# Altium schematic sheet 04 SWITCH.SchDoc
size A3
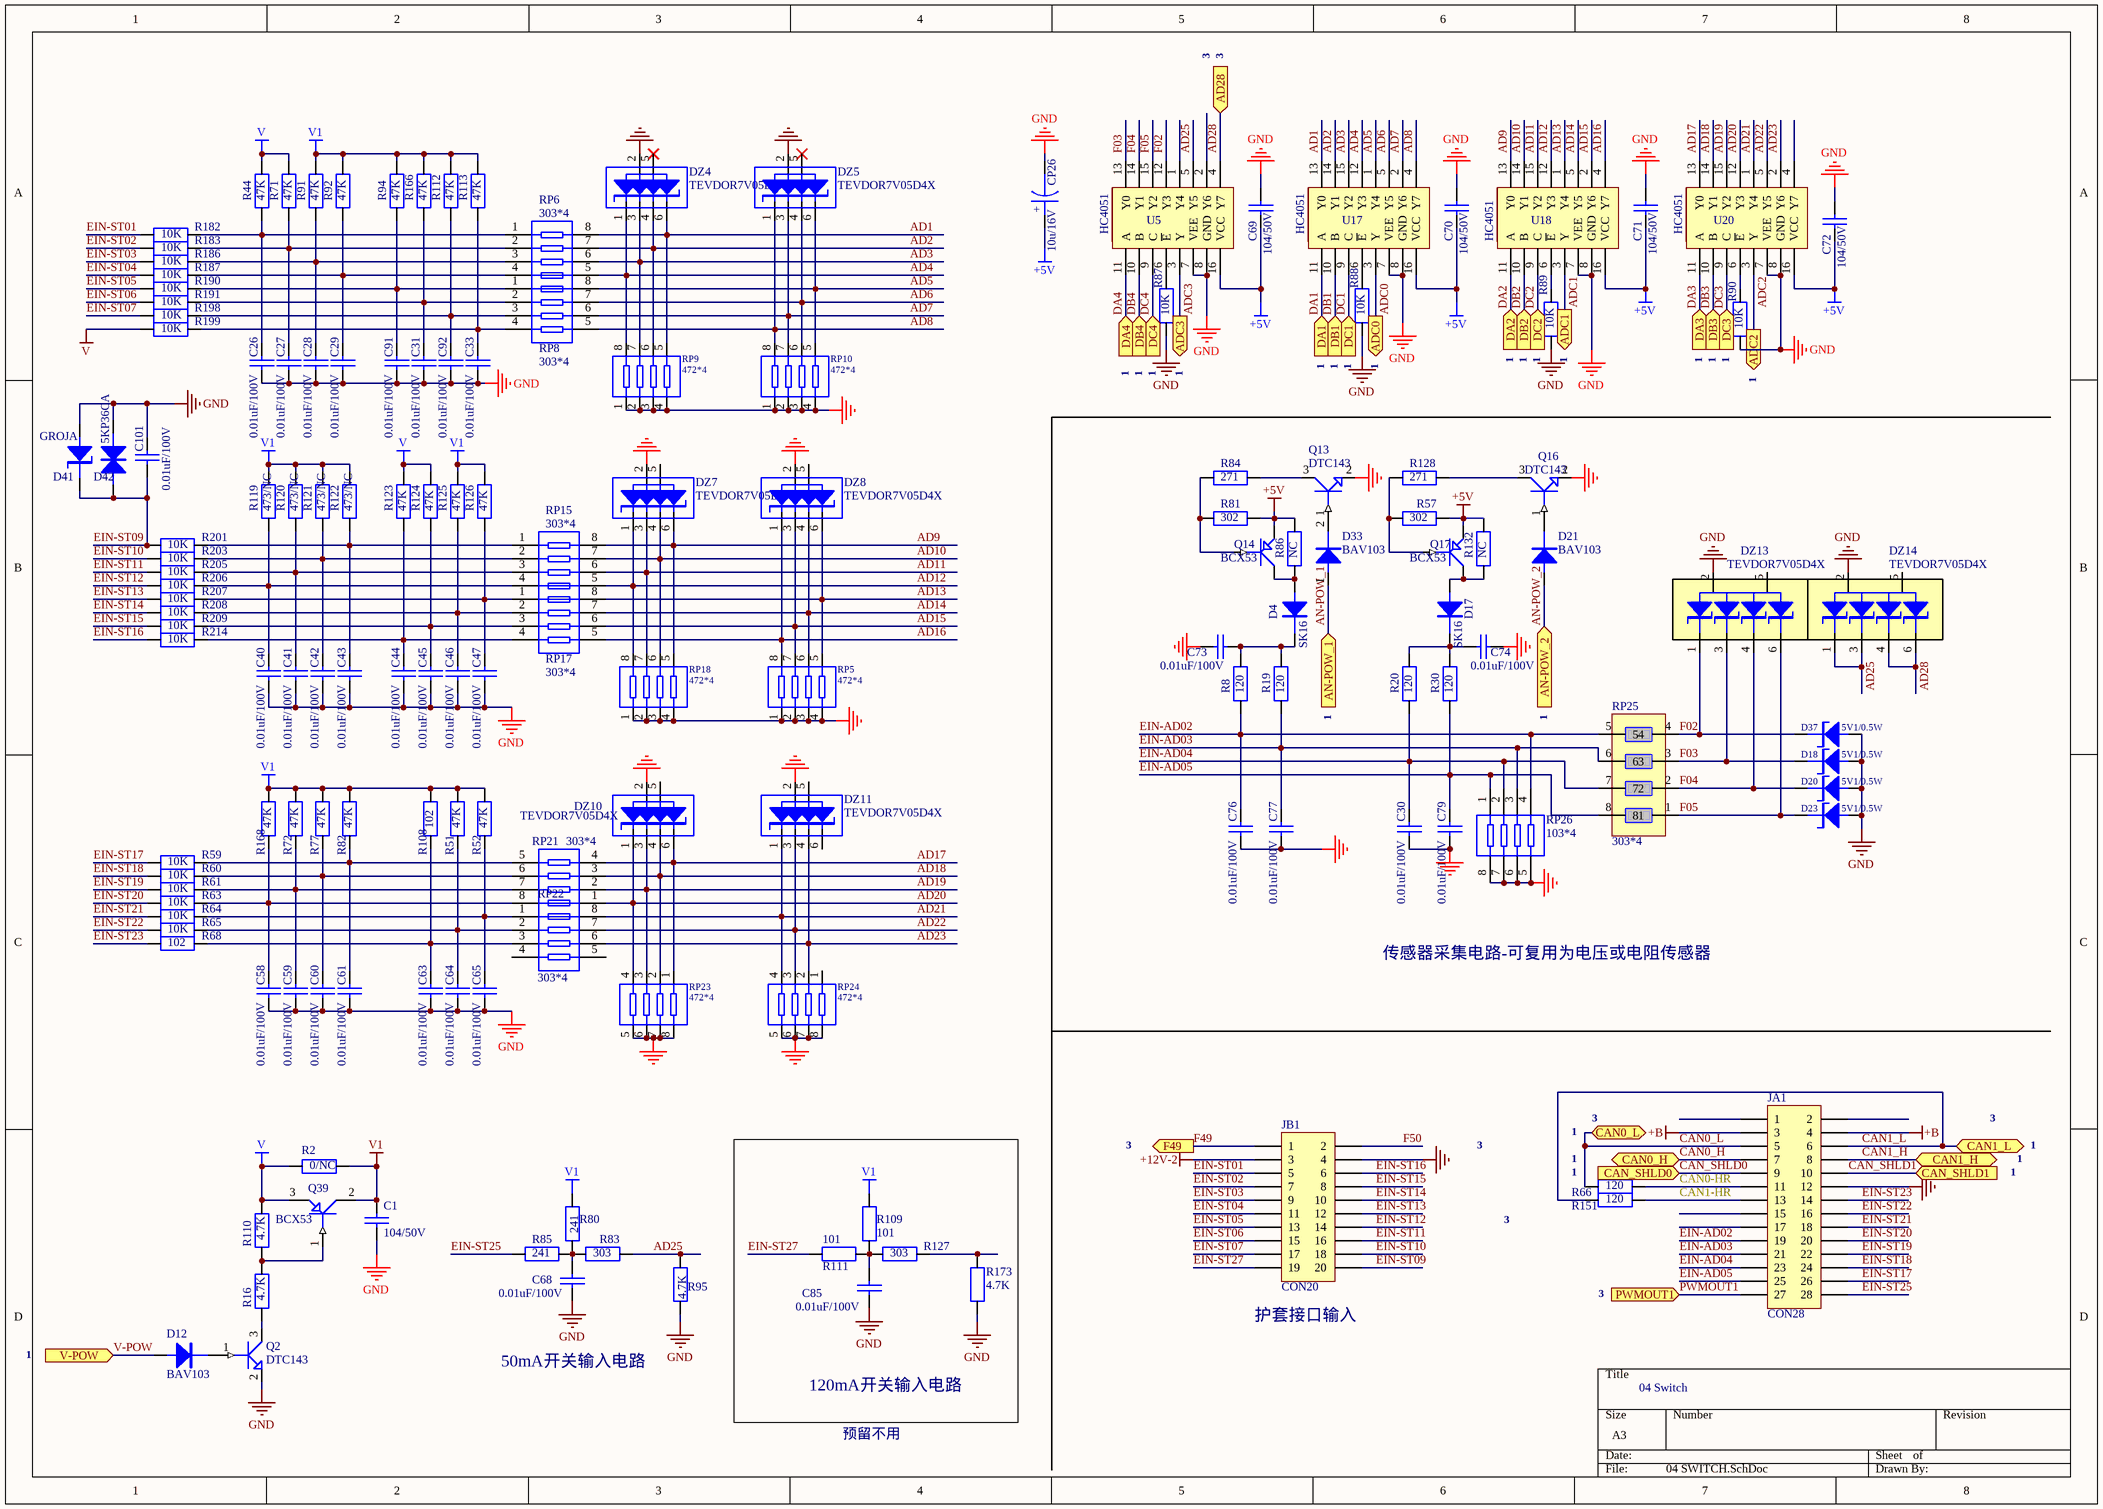
[diagram p0: 04 SWITCH.SchDoc]

## Parts
C1  104/50V  [CR0805]
C26  0.01uF/100V  [CR0805]
C27  0.01uF/100V  [CR0805]
C28  0.01uF/100V  [CR0805]
C29  0.01uF/100V  [CR0805]
C30  0.01uF/100V  [CR0805]
C31  0.01uF/100V  [CR0805]
C33  0.01uF/100V  [CR0805]
C40  0.01uF/100V  [CR0805]
C41  0.01uF/100V  [CR0805]
C42  0.01uF/100V  [CR0805]
C43  0.01uF/100V  [CR0805]
C44  0.01uF/100V  [CR0805]
C45  0.01uF/100V  [CR0805]
C46  0.01uF/100V  [CR0805]
C47  0.01uF/100V  [CR0805]
C58  0.01uF/100V  [CR0805]
C59  0.01uF/100V  [CR0805]
C60  0.01uF/100V  [CR0805]
C61  0.01uF/100V  [CR0805]
C63  0.01uF/100V  [CR0805]
C64  0.01uF/100V  [CR0805]
C65  0.01uF/100V  [CR0805]
C68  0.01uF/100V  [CR0805]
C69  104/50V  [CR0805]
C70  104/50V  [CR0805]
C71  104/50V  [CR0805]
C72  104/50V  [CR0805]
C73  0.01uF/100V  [CR0805]
C74  0.01uF/100V  [CR0805]
C76  0.01uF/100V  [CR0805]
C77  0.01uF/100V  [CR0805]
C79  0.01uF/100V  [CR0805]
C85  0.01uF/100V  [CR0805]
C91  0.01uF/100V  [CR0805]
C92  0.01uF/100V  [CR0805]
C101  0.01uF/100V  [CR0805]
CP26  10u/16V  [CE1206]
D4  SK16  [SMA]
D12  BAV103  [SOD-80C]
D17  SK16  [SMA]
D18  5V1/0.5W  [SOD-80C]
D20  5V1/0.5W  [SOD-80C]
D21  BAV103  [SOD-80C]
D23  5V1/0.5W  [SOD-80C]
D33  BAV103  [SOD-80C]
D37  5V1/0.5W  [SOD-80C]
D41  GROJA  [SMA]
D42  5KP36CA  [SMB-D]
DZ4  TEVDOR7V05D4X  [SOT-457]
DZ5  TEVDOR7V05D4X  [SOT-457]
DZ7  TEVDOR7V05D4X  [SOT-457]
DZ8  TEVDOR7V05D4X  [SOT-457]
DZ10  TEVDOR7V05D4X  [SOT-457]
DZ11  TEVDOR7V05D4X  [SOT-457]
DZ13  TEVDOR7V05D4X  [SOT-457]
DZ14  TEVDOR7V05D4X  [SOT-457]
JA1  CON28  [AMP DIP28]
JB1  CON20  [AMP DIP20]
Q2  DTC143  [SOT23]
Q13  DTC143  [SOT23]
Q14  BCX53  [SOT89]
Q16  DTC143  [SOT23]
Q17  BCX53  [SOT89]
Q39  BCX53  [SOT89]
R2  0/NC  [CR1206]
R8  120  [CR1206]
R16  4.7K  [CR1206]
R19  120  [CR1206]
R20  120  [CR1206]
R30  120  [CR1206]
R44  47K  [CR0805]
R51  47K  [CR0805]
R52  47K  [CR0805]
R57  302  [CR0805]
R59  10K  [CR1206]
R60  10K  [CR1206]
R61  10K  [CR1206]
R63  10K  [CR1206]
R64  10K  [CR1206]
R65  10K  [CR1206]
R66  120  [CR0805]
R68  102  [CR2010]
R71  47K  [CR0805]
R72  47K  [CR0805]
R77  47K  [CR0805]
R80  241  [R-3W]
R81  302  [CR0805]
R82  47K  [CR0805]
R83  303  [CR0805]
R84  271  [CR0805]
R85  241  [R-3W]
R86  NC  [CR1206]
R87  10K  [CR0805]
R88  10K  [CR0805]
R89  10K  [CR0805]
R90  10K  [CR0805]
R91  47K  [CR0805]
R92  47K  [CR0805]
R94  47K  [CR0805]
R95  4.7K  [CR0805]
R108  102  [CR2010]
R109  101  [R-3W]
R110  4.7K  [CR0805]
R111  101  [R-3W]
R112  47K  [CR0805]
R113  47K  [CR0805]
R119  473/NC  [CR0805]
R120  473/NC  [CR0805]
R121  473/NC  [CR0805]
R122  473/NC  [CR0805]
R123  47K  [CR0805]
R124  47K  [CR0805]
R125  47K  [CR0805]
R126  47K  [CR0805]
R127  303  [CR0805]
R128  271  [CR0805]
R132  NC  [CR1206]
R151  120  [CR0805]
R166  47K  [CR0805]
R168  47K  [CR0805]
R173  4.7K  [CR0805]
R182  10K  [CR1206]
R183  10K  [CR1206]
R186  10K  [CR1206]
R187  10K  [CR1206]
R190  10K  [CR1206]
R191  10K  [CR1206]
R198  10K  [CR1206]
R199  10K  [CR1206]
R201  10K  [CR1206]
R203  10K  [CR1206]
R205  10K  [CR1206]
R206  10K  [CR1206]
R207  10K  [CR1206]
R208  10K  [CR1206]
R209  10K  [CR1206]
R214  10K  [CR1206]
RP5  472*4  [R4]
RP6  303*4  [R4]
RP8  303*4  [R4]
RP9  472*4  [R4]
RP10  472*4  [R4]
RP15  303*4  [R4]
RP17  303*4  [R4]
RP18  472*4  [R4]
RP21  303*4  [R4]
RP22  303*4  [R4]
RP23  472*4  [R4]
RP24  472*4  [R4]
RP25  303*4  [R4]
RP26  103*4  [R4]
U5  HC4051  [SO-16]
U17  HC4051  [SO-16]
U18  HC4051  [SO-16]
U20  HC4051  [SO-16]

## Ports
AD28 (in), ADC0 (out), ADC1 (out), ADC2 (out), ADC3 (out), AN-POW_1 (in), AN-POW_2 (in), CAN0_H (bidir), CAN0_L (bidir), CAN1_H (bidir), CAN1_L (bidir), CAN_SHLD0 (in), CAN_SHLD1 (in), DA1 (in), DA2 (in), DA3 (in), DA4 (in), DB1 (in), DB2 (in), DB3 (in), DB4 (in), DC1 (in), DC2 (in), DC3 (in), DC4 (in), F49 (out), PWMOUT1 (in), V-POW (in)

## Nets
+5V: C69.2 C70.2 C71.2 C72.2 CP26.1 Q14.3(E) Q17.3(E) R57.1 R81.1 R86.1 R132.1 U5.16(VCC) U17.16(VCC) U18.16(VCC) U20.16(VCC)
+12V-2: JB1.3
+B: JA1.3 JA1.4
GND: C1.2 C26.2 C27.2 C28.2 C29.2 C30.2 C31.2 C33.2 C40.2 C41.2 C42.2 C43.2 C44.2 C45.2 C46.2 C47.2 C58.2 C59.2 C60.2 C61.2 C63.2 C64.2 C65.2 C68.2 C69.1 C70.1 C71.1 C72.1 C73.1 C74.2 C76.2 C77.2 C79.2 C85.2 C91.2 C92.2 C101.1 CP26.2 D18.1(A) D20.1(A) D23.1(A) D37.1(A) D41.1(A) D42.1 DZ4.2 DZ5.2 DZ7.2 DZ8.2 DZ10.2 DZ11.2 DZ13.2 DZ14.2 JA1.12 JB1.4 Q2.2(gnd) Q13.2(gnd) Q16.2(gnd) R87.2 R88.2 R89.2 R90.2 R95.1 R173.1 RP5.1 RP5.2 RP5.3 RP5.4 RP9.1 RP9.2 RP9.3 RP9.4 RP10.1 RP10.2 RP10.3 RP10.4 RP18.1 RP18.2 RP18.3 RP18.4 RP23.5 RP23.6 RP23.7 RP23.8 RP24.5 RP24.6 RP24.7 RP24.8 RP26.5 RP26.6 RP26.7 RP26.8 U5.7(VEE) U5.8(GND) U17.7(VEE) U17.8(GND) U18.7(VEE) U18.8(GND) U20.7(VEE) U20.8(GND)
V: Q39.3(C) R2.1 R44.2 R71.2 R110.2 R123.2 R124.2 R199.1
V1: C1.1 Q39.2(E) R2.2 R51.2 R52.2 R72.2 R77.2 R80.2 R82.2 R91.2 R92.2 R94.2 R108.2 R109.2 R112.2 R113.2 R119.2 R120.2 R121.2 R122.2 R125.2 R126.2 R166.2 R168.2
AD1: DZ4.6 RP6.8 RP9.5 U17.13(Y0)
AD2: DZ4.4 RP6.7 RP9.6 U17.14(Y1)
AD3: DZ4.3 RP6.6 RP9.7 U17.15(Y2)
AD4: DZ4.1 RP6.5 RP9.8 U17.12(Y3)
AD5: DZ5.6 RP8.8 RP10.5 U17.1(Y4)
AD6: DZ5.4 RP8.7 RP10.6 U17.5(Y5)
AD7: DZ5.3 RP8.6 RP10.7 U17.2(Y6)
AD8: DZ5.1 RP8.5 RP10.8 U17.4(Y7)
AD9: DZ7.6 RP15.8 RP18.5 U18.13(Y0)
AD10: DZ7.4 RP15.7 RP18.6 U18.14(Y1)
AD11: DZ7.3 RP15.6 RP18.7 U18.15(Y2)
AD12: DZ7.1 RP15.5 RP18.8 U18.12(Y3)
AD13: DZ8.6 RP5.5 RP17.8 U18.1(Y4)
AD14: DZ8.4 RP5.6 RP17.7 U18.5(Y5)
AD15: DZ8.3 RP5.7 RP17.6 U18.2(Y6)
AD16: DZ8.1 RP5.8 RP17.5 U18.4(Y7)
AD17: DZ10.6 RP21.4 RP23.1 U20.13(Y0)
AD18: DZ10.4 RP21.3 RP23.2 U20.14(Y1)
AD19: DZ10.3 RP21.2 RP23.3 U20.15(Y2)
AD20: DZ10.1 RP21.1 RP23.4 U20.12(Y3)
AD21: DZ11.1 RP22.8 RP24.4 U20.1(Y4)
AD22: DZ11.3 RP22.7 RP24.3 U20.5(Y5)
AD23: DZ11.4 RP22.6 RP24.2 U20.2(Y6)
AD25: DZ14.1 DZ14.3 R83.2 R95.2 U5.5(Y5)
AD28: DZ14.4 DZ14.6 U5.4(Y7) ; port AD28
ADC0: U17.3(Y) ; port ADC0
ADC1: U18.3(Y) ; port ADC1
ADC2: U20.3(Y) ; port ADC2
ADC3: U5.3(Y) ; port ADC3
AN-POW_1: D33.1(A) ; port AN-POW_1
AN-POW_2: D21.1(A) ; port AN-POW_2
CAN0-HR: JA1.11 R66.2
CAN0_H: JA1.7 ; port CAN0_H
CAN0_L: JA1.5 R66.1 ; port CAN0_L
CAN1-HR: JA1.13 R151.1
CAN1_H: JA1.8 ; port CAN1_H
CAN1_L: JA1.6 R151.2 ; port CAN1_L
CAN_SHLD0: JA1.9 ; port CAN_SHLD0
CAN_SHLD1: JA1.10 ; port CAN_SHLD1
DA1: U17.11(A) ; port DA1
DA2: U18.11(A) ; port DA2
DA3: U20.11(A) ; port DA3
DA4: U5.11(A) ; port DA4
DB1: U17.10(B) ; port DB1
DB2: U18.10(B) ; port DB2
DB3: U20.10(B) ; port DB3
DB4: U5.10(B) ; port DB4
DC1: U17.9(C) ; port DC1
DC2: U18.9(C) ; port DC2
DC3: U20.9(C) ; port DC3
DC4: U5.9(C) ; port DC4
EIN-AD02: C76.1 JA1.19 R8.2 RP25.5 RP26.4
EIN-AD03: C77.1 JA1.21 R19.2 RP25.6 RP26.3
EIN-AD04: C30.1 JA1.23 R20.2 RP25.7 RP26.2
EIN-AD05: C79.1 JA1.25 R30.2 RP25.8 RP26.1
EIN-ST01: JB1.5 R182.1
EIN-ST02: JB1.7 R183.1
EIN-ST03: JB1.9 R186.1
EIN-ST04: JB1.11 R187.1
EIN-ST05: JB1.13 R190.1
EIN-ST06: JB1.15 R191.1
EIN-ST07: JB1.17 R198.1
EIN-ST09: C101.2 D41.2(K) D42.2 JB1.20 R201.1
EIN-ST10: JB1.18 R203.1
EIN-ST11: JB1.16 R205.1
EIN-ST12: JB1.14 R206.1
EIN-ST13: JB1.12 R207.1
EIN-ST14: JB1.10 R208.1
EIN-ST15: JB1.8 R209.1
EIN-ST16: JB1.6 R214.1
EIN-ST17: JA1.26 R59.1
EIN-ST18: JA1.24 R60.1
EIN-ST19: JA1.22 R61.1
EIN-ST20: JA1.20 R63.1
EIN-ST21: JA1.18 R64.1
EIN-ST22: JA1.16 R65.1
EIN-ST23: JA1.14 R68.1
EIN-ST25: JA1.28 R85.1
EIN-ST27: JB1.19 R111.1
F02: D37.2(K) DZ13.1 RP25.4 U5.12(Y3)
F03: D18.2(K) DZ13.3 RP25.3 U5.13(Y0)
F04: D20.2(K) DZ13.4 RP25.2 U5.14(Y1)
F05: D23.2(K) DZ13.6 RP25.1 U5.15(Y2)
F49: JB1.1 ; port F49
F50: JB1.2
PWMOUT1: JA1.27 ; port PWMOUT1
V-POW: D12.1(A) ; port V-POW
NetC26_1: C26.1 R44.1 R182.2 RP6.1
NetC27_1: C27.1 R71.1 R183.2 RP6.2
NetC28_1: C28.1 R91.1 R186.2 RP6.3
NetC29_1: C29.1 R92.1 R187.2 RP6.4
NetC31_1: C31.1 R166.1 R191.2 RP8.2
NetC33_1: C33.1 R113.1 R199.2 RP8.4
NetC40_1: C40.1 R119.1 R206.2 RP15.4
NetC41_1: C41.1 R120.1 R205.2 RP15.3
NetC42_1: C42.1 R121.1 R203.2 RP15.2
NetC43_1: C43.1 R122.1 R201.2 RP15.1
NetC44_1: C44.1 R123.1 R214.2 RP17.4
NetC45_1: C45.1 R124.1 R209.2 RP17.3
NetC46_1: C46.1 R125.1 R208.2 RP17.2
NetC47_1: C47.1 R126.1 R207.2 RP17.1
NetC58_1: C58.1 R63.2 R168.1 RP21.8
NetC59_1: C59.1 R61.2 R72.1 RP21.7
NetC60_1: C60.1 R60.2 R77.1 RP21.6
NetC61_1: C61.1 R59.2 R82.1 RP21.5
NetC63_1: C63.1 R68.2 R108.1 RP22.3
NetC64_1: C64.1 R51.1 R65.2 RP22.2
NetC65_1: C65.1 R52.1 R64.2 RP22.1
NetC68_1: C68.1 R80.1 R83.1 R85.2
NetC73_2: C73.2 D4.2(K) R8.1 R19.1
NetC74_1: C74.1 D17.2(K) R20.1 R30.1
NetC85_1: C85.1 R109.1 R111.2 R127.1
NetC91_1: C91.1 R94.1 R190.2 RP8.1
NetC92_1: C92.1 R112.1 R198.2 RP8.3
NetD4_1: D4.1(A) Q14.2(C) R86.2
NetD12_2: D12.2(K) Q2.1(in)
NetD17_1: D17.1(A) Q17.2(C) R132.2
NetD21_2: D21.2(K) Q16.1(in)
NetD33_2: D33.2(K) Q13.1(in)
NetQ2_3: Q2.3(out) R16.1
NetQ13_3: Q13.3(out) R84.2
NetQ14_1: Q14.1(B) R81.2 R84.1
NetQ16_3: Q16.3(out) R128.1
NetQ17_1: Q17.1(B) R57.2 R128.2
NetQ39_1: Q39.1(B) R16.2 R110.1
NetR87_1: R87.1 U5.6(~{E})
NetR88_1: R88.1 U17.6(~{E})
NetR89_1: R89.1 U18.6(~{E})
NetR90_1: R90.1 U20.6(~{E})
NetR127_2: R127.2 R173.2

Not connected (* = marked no-connect by the designer): DZ4 5*; DZ5 5*; DZ7 5; DZ8 5; DZ10 5; DZ11 5 6; DZ13 5; DZ14 5; JA1 1 2 15 17; RP22 4 5; RP24 1; U5 1(Y4) 2(Y6); U20 4(Y7)

## Notes on the sheet
- 3
- 1
- (near R87) 1
- (near R88) 1
- (near R89) 1
- (near R90) 1
- (near R19) 1
- 传感器采集电路-可复用为电压或电阻传感器
- (near JB1) 护套接口输入
- 50mA开关输入电路
- 120mA开关输入电路
- 04 Switch
- 预留不用
- (in symbol CAPACITOR POL) +

## Library data of the parts
C1 = CAP: 贴片电容
C26-C31 C33 C40-C47 C58-C61 C63-C65 C68-C74 C76 C77 C79 C85 C91 C92 C101 = CAP: Capacitor
CP26 = CAPACITOR POL: Capacitor
D4 D12 D17 D21 D33 = DIODE: 二极管
D18 D20 D23 D37 D41 = DW: 稳压二极管
D42 = TVS
DZ4 DZ5 DZ7 DZ8 DZ10 DZ11 DZ13 DZ14 = BZA456G: 二极管排
Q2 Q13 Q16 = DTC143: NPN; HelpURL: G:\资料\规格书\二三极管\dtc143ee.pdf
Q14 Q17 = PNP1: 贴片三极管
Q39 = BSP631: PNP三极管
R2 R8 R16 R19 R20 R30 R44 R51 R52 R57 R59-R61 R63-R66 R68 R71 R72 R77 R80-R92 R94 R95 R108-R113 R119-R128 R132 R151 R166 R168 R173 R182 R183 R186 R187 R190 R191 R198 R199 R201 R203 R205-R209 R214 = RES: 贴片电阻
RP5 RP9 RP10 RP18 RP23 RP24 = RN: 排阻
RP6 RP8 RP15 RP17 RP21 RP22 = R_LINE4: 贴片排阻
RP25 = R_ARRAY
RP26 = R_LINE4: 排阻
U5 U17 U18 U20 = HC4051: IC-8路模拟开关集成快; HelpURL: G:\资料\规格书\数字逻辑\74HC4051.pdf